# EAGLE design Strip-Con_board (EAGLE 9.6.2)
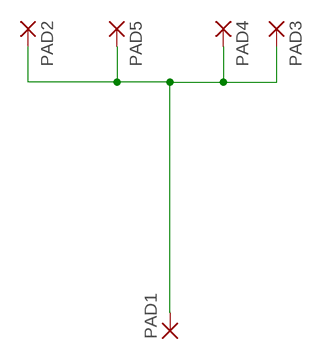
[diagram p0: schematic, sheet 1]

## Parts
PAD1  SMD5  [SMD2,54-5,08]
PAD2  SMD5  [SMD2,54-5,08]
PAD3  SMD5  [SMD2,54-5,08]
PAD4  SMD5  [SMD2,54-5,08]
PAD5  SMD5  [SMD2,54-5,08]

## Nets
N$1: PAD1.1(P) PAD2.1(P) PAD3.1(P) PAD4.1(P) PAD5.1(P)

## Library data of the parts
PAD1-PAD5 = wirepad:SMD5: SMD PAD

## Board
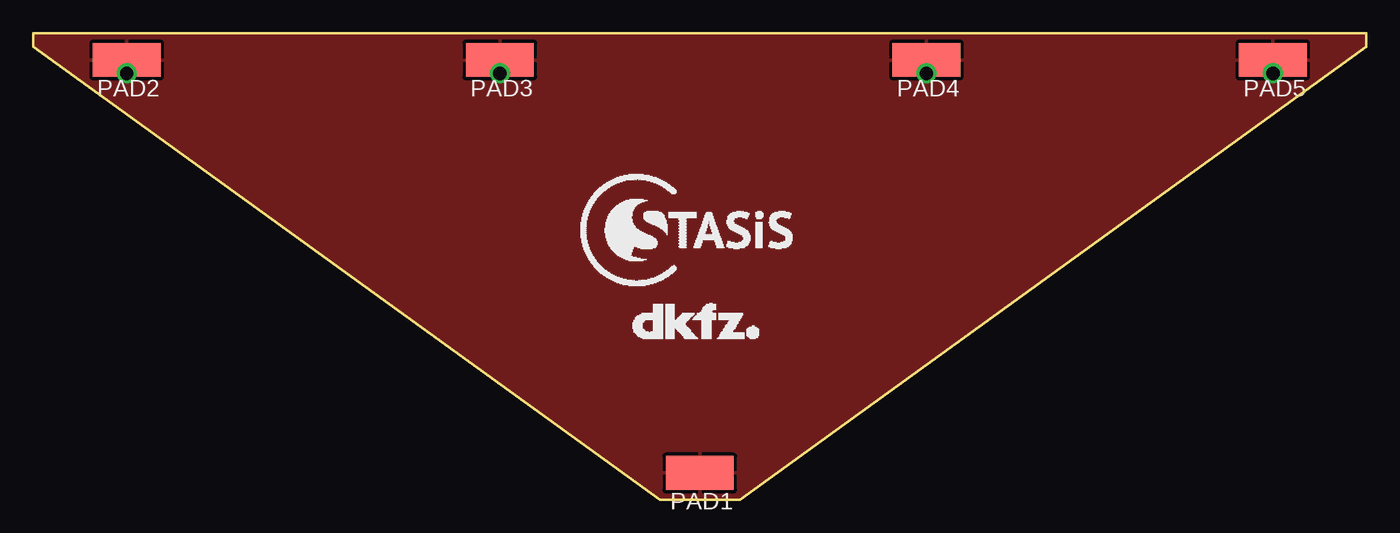
[diagram p1: board, top side]

Size 100 x 35 mm. Coordinates in mm from the lower left corner, seen from the top.
Outline: 47,0 53,0 100,34 100,35 0,35 0,34 47,0
Copper layers (1*16): Top 0.035mm / dielectric 1.5mm / Bottom 0.035mm
Design rules "default *": minimum track width 6mil, minimum drill 0.35mm, track to track 6mil, track to pad 6mil, pad to pad 6mil, via to via 6mil, smd to smd 6mil, copper to edge 0mil, drill to drill 6mil, minimum pad ring 10mil, minimum via ring 8mil, stop-mask expansion 4mil, vias tented up to drill 0mil, thermal gap 10mil

### Footprints (pad centres in the part's own frame; a part is rotated, then mirrored left to right if it is on the bottom)
SMD2,54-5,08 = smd 2.54 x 5.08: 1 0,0

### Placement (x,y rotation side)
PAD1  50,2 90 top
PAD2  7,33 90 top
PAD3  35,33 90 top
PAD4  67,33 90 top
PAD5  93,33 90 top
U$1  [LOGO_STASIS]  50,20 0 top
U$2  [LOGO_DKFZ]  45,12 0 top

### Tracks (layer width: path | path; a pad name or v marks a point on that pad's centre or on a via)
N$1  (via drill 1)
  other vias: 7,32 35,32 67,32 93,32
  pour Top: 1,35 100,35 100,34 53,0 47,0 0,34 0,35